# Altium schematic sheet [4]-DISPLAY.SchDoc
size A
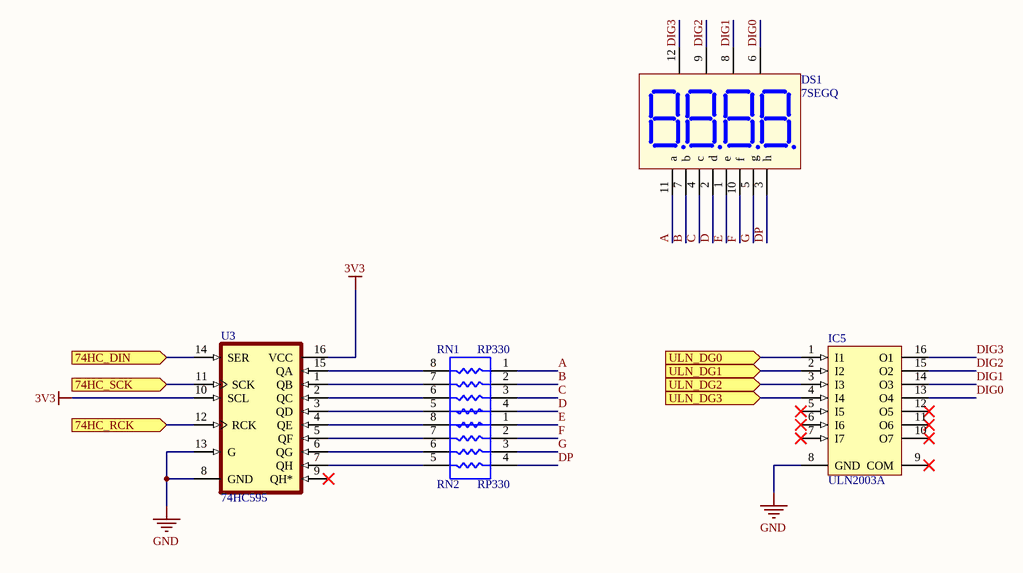
[diagram p0: [4]-DISPLAY.SchDoc]

## Parts
DS1  7SEGQ  [LED7SEG-4-0.36]
IC5  ULN2003A  [SOIC16]
RN1  RP330  [RN4-0805]
RN2  RP330  [RN4-0805]
U3  74HC595  [SOIC16]

## Ports
74HC_DIN (in), 74HC_RCK (in), 74HC_SCK (in), ULN_DG0 (in), ULN_DG1 (in), ULN_DG2 (in), ULN_DG3 (in)

## Nets
3V3: U3.10(SCL) U3.16(VCC)
GND: IC5.8(GND) U3.8(GND) U3.13(G)
74HC_DIN: U3.14(SER) ; port 74HC_DIN
74HC_RCK: U3.12(RCK) ; port 74HC_RCK
74HC_SCK: U3.11(SCK) ; port 74HC_SCK
A: DS1.11(a) RN1.1
B: DS1.7(b) RN1.2
C: DS1.4(c) RN1.3
D: DS1.2(d) RN1.4
DIG0: DS1.6(V4) IC5.13(O4)
DIG1: DS1.8(V3) IC5.14(O3)
DIG2: DS1.9(V2) IC5.15(O2)
DIG3: DS1.12(V1) IC5.16(O1)
DP: DS1.3(h) RN2.4
E: DS1.1(e) RN2.1
F: DS1.10(f) RN2.2
G: DS1.5(g) RN2.3
ULN_DG0: IC5.1(I1) ; port ULN_DG0
ULN_DG1: IC5.2(I2) ; port ULN_DG1
ULN_DG2: IC5.3(I3) ; port ULN_DG2
ULN_DG3: IC5.4(I4) ; port ULN_DG3
NetRN1_5: RN1.5 U3.3(QD)
NetRN1_6: RN1.6 U3.2(QC)
NetRN1_7: RN1.7 U3.1(QB)
NetRN1_8: RN1.8 U3.15(QA)
NetRN2_5: RN2.5 U3.7(QH)
NetRN2_6: RN2.6 U3.6(QG)
NetRN2_7: RN2.7 U3.5(QF)
NetRN2_8: RN2.8 U3.4(QE)

Not connected (* = marked no-connect by the designer): IC5 5(I5)* 6(I6)* 7(I7)* 9(COM)* 10(O7)* 11(O6)* 12(O5)*; U3 9(QH*)*

## Library data of the parts
DS1 = LED7SEG-4: Four 7 Seg Dipslay; Value: LED 7Q SEG
IC5 = ULN2003A: High-Voltage, High-Current Darlington Array; LatestRevisionNote: Stylized 3D Model Added.; Publisher: Altium Limited; Value: ULN2003A
RN1 RN2 = RN4-Dual
U3 = 74HC595: 8-bit Serial-Input/Serial or Parallel Output Shift Register with Latched 3-state Outputs